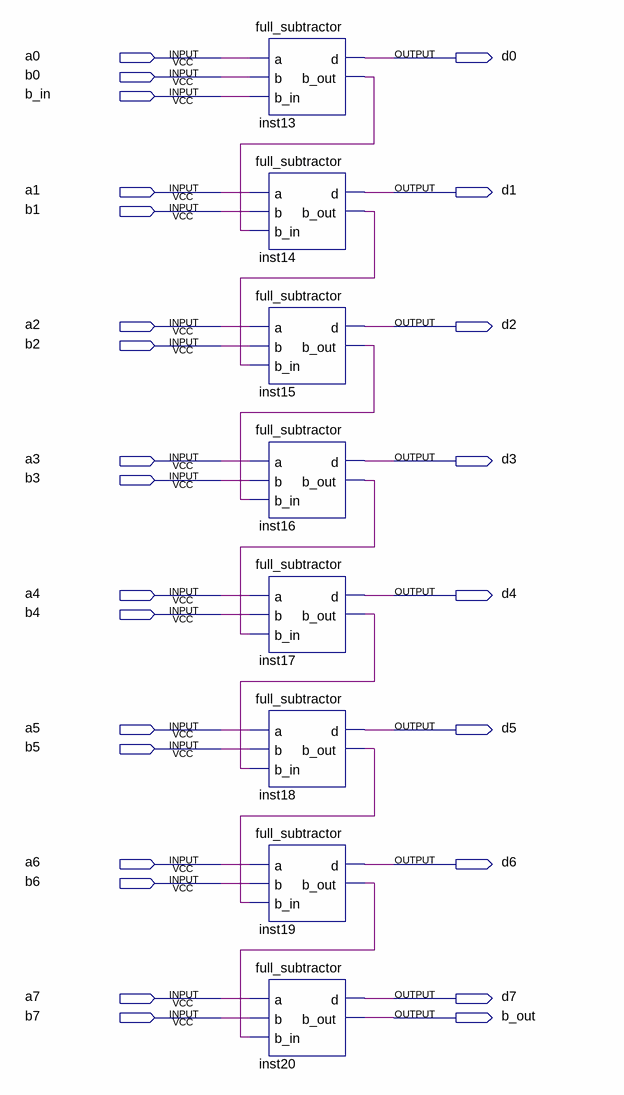
[diagram p0: schematic sheet]
// Quartus schematic subtractor8.bdf as structural Verilog: 8 symbols, 26 pins
module subtractor8 (
  input  a0,
  input  b0,
  input  b_in,
  input  a1,
  input  b1,
  input  a2,
  input  b2,
  input  a3,
  input  b3,
  input  a4,
  input  b4,
  input  a5,
  input  b5,
  input  a6,
  input  b6,
  input  a7,
  input  b7,
  output d0,
  output d1,
  output d2,
  output d3,
  output d4,
  output d5,
  output d6,
  output d7,
  output b_out
);

  wire inst13_b_out, inst14_b_out, inst15_b_out, inst16_b_out, inst17_b_out, inst18_b_out, inst19_b_out;

  full_subtractor inst13 (.a(a0), .b(b0), .b_in(b_in), .d(d0), .b_out(inst13_b_out));
  full_subtractor inst14 (.a(a1), .b(b1), .b_in(inst13_b_out), .d(d1), .b_out(inst14_b_out));
  full_subtractor inst15 (.a(a2), .b(b2), .b_in(inst14_b_out), .d(d2), .b_out(inst15_b_out));
  full_subtractor inst16 (.a(a3), .b(b3), .b_in(inst15_b_out), .d(d3), .b_out(inst16_b_out));
  full_subtractor inst17 (.a(a4), .b(b4), .b_in(inst16_b_out), .d(d4), .b_out(inst17_b_out));
  full_subtractor inst18 (.a(a5), .b(b5), .b_in(inst17_b_out), .d(d5), .b_out(inst18_b_out));
  full_subtractor inst19 (.a(a6), .b(b6), .b_in(inst18_b_out), .d(d6), .b_out(inst19_b_out));
  full_subtractor inst20 (.a(a7), .b(b7), .b_in(inst19_b_out), .d(d7), .b_out(b_out));
endmodule
